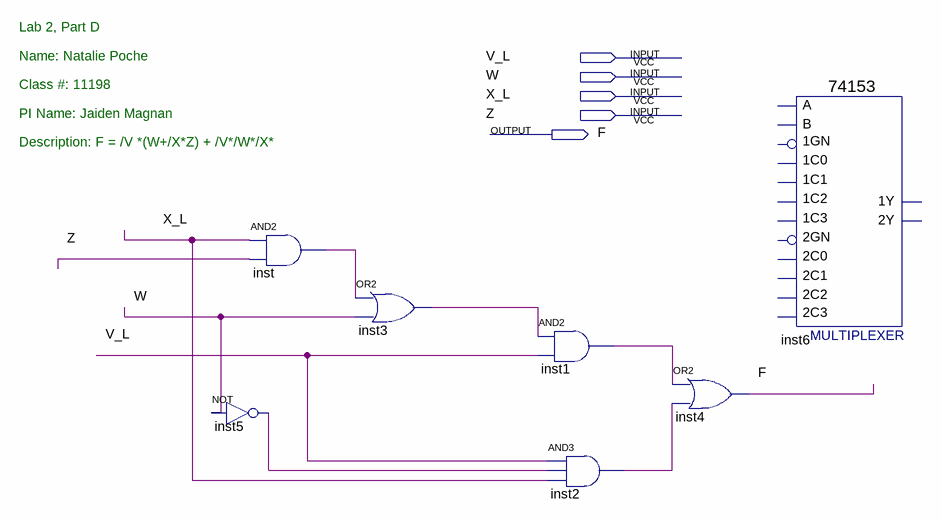
[diagram p0: schematic sheet]
// Quartus schematic lab2_EQU.bdf as structural Verilog: 7 symbols, 5 pins
module lab2_EQU (
  input  V_L,
  input  W,
  input  X_L,
  input  Z,
  output F
);

  wire inst1_out, inst2_out, inst3_out, inst5_out, inst_out;

  not inst5 (inst5_out, W);
  and inst (inst_out, X_L, Z);
  or inst3 (inst3_out, inst_out, W);
  and inst1 (inst1_out, inst3_out, V_L);
  and inst2 (inst2_out, V_L, inst5_out, X_L);
  or inst4 (F, inst1_out, inst2_out);
  \74153  inst6 ();  // open: 1C1, 1GN, 1C0, 2C0, 2GN, 2C2, 1C2, 1C3, B, A, 2C1, 2C3, 1Y, 2Y

  // Notes on the sheet:
  //   Lab 2, Part D
  //   Name: Natalie Poche
  //   Class #: 11198
  //   PI Name: Jaiden Magnan
  //   Description: F = /V *(W+/X*Z) + /V*/W*/X*
endmodule
